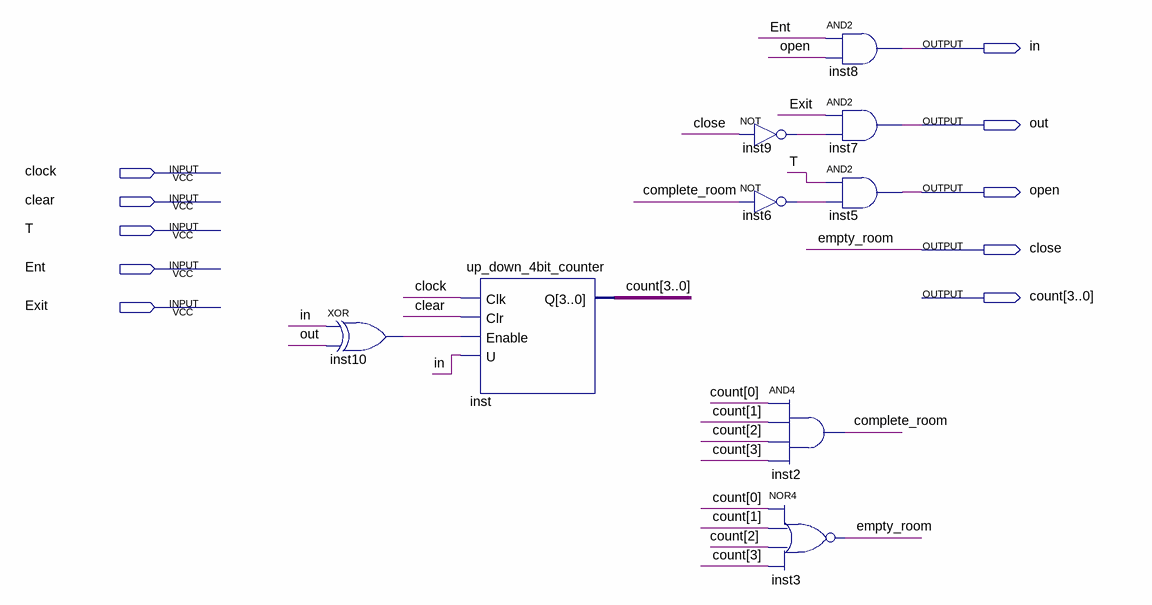
[diagram p0: schematic sheet]
// Quartus schematic entry_room_control_system_main_circuit.bdf as structural Verilog: 9 symbols, 10 pins
module entry_room_control_system_main_circuit (
  input  clock,
  input  clear,
  input  T,
  input  Ent,
  input  Exit,
  output in,
  output out,
  output open,
  output close,
  output [3:0] count
);

  wire complete_room, inst6_out, inst9_out, inst10_out;

  xor inst10 (inst10_out, in, out);
  up_down_4bit_counter inst (.Clk(clock), .Clr(clear), .Enable(inst10_out), .U(in), .Q(count));
  not inst9 (inst9_out, close);
  not inst6 (inst6_out, complete_room);
  and inst2 (complete_room, count[0], count[1], count[2], count[3]);
  nor inst3 (close, count[0], count[1], count[2], count[3]);
  and inst8 (in, Ent, open);
  and inst7 (out, Exit, inst9_out);
  and inst5 (open, T, inst6_out);

  // Other names for the same wires on the sheet: empty_room = close
endmodule
